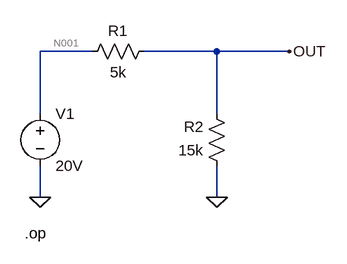
[diagram p0: schematic DC Operating Point Analysis.asc]
DC Operating Point Analysis.asc, the LTspice schematic file:
Version 4
SHEET 1 880 680
WIRE 160 48 80 48
WIRE 352 48 240 48
WIRE 464 48 352 48
WIRE 80 144 80 48
WIRE 352 144 352 48
WIRE 80 272 80 224
WIRE 352 272 352 224
FLAG 80 272 0
FLAG 352 272 0
FLAG 464 48 OUT
SYMBOL voltage 80 128 R0
SYMATTR InstName V1
SYMATTR Value 20V
SYMBOL res 256 32 R90
WINDOW 0 0 56 VBottom 2
WINDOW 3 32 56 VTop 2
SYMATTR InstName R1
SYMATTR Value 5k
SYMBOL res 368 240 R180
WINDOW 0 36 76 Left 2
WINDOW 3 36 40 Left 2
SYMATTR InstName R2
SYMATTR Value 15k
TEXT 56 328 Left 2 !.op

The netlist it stands for:
* DC Operating Point Analysis.asc
V1 N001 0 20V
R1 OUT N001 5k
R2 0 OUT 15k
.op
.backanno
.end

* Results of the author's LTspice run, read from the files saved beside the schematic
* Operating Point:
*   V(n001) = 20 V
*   V(out) = 15 V
*   I(R2) = -1 mA
*   I(R1) = -1 mA
*   I(V1) = -1 mA